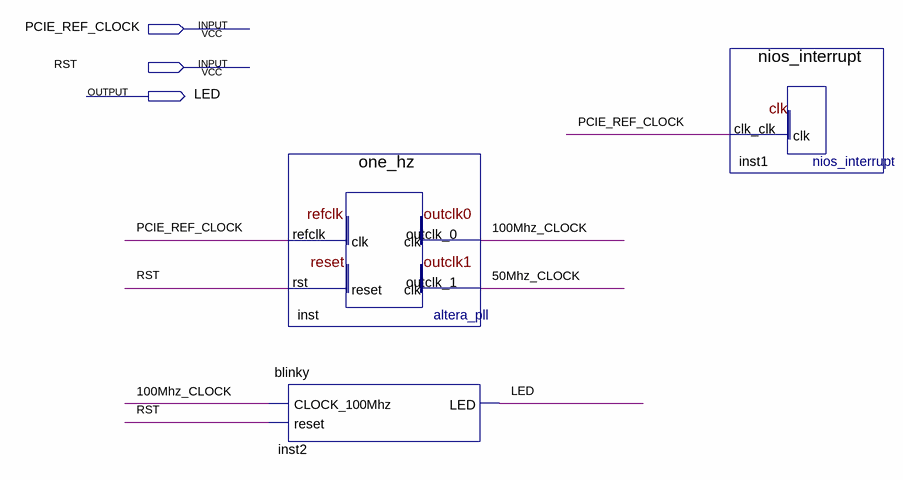
[diagram p0: schematic sheet]
// Quartus schematic Top_module.bdf as structural Verilog: 3 symbols, 3 pins
module Top_module (
  input  PCIE_REF_CLOCK,
  input  RST,
  output LED
);

  wire \50Mhz_CLOCK , \100Mhz_CLOCK ;

  one_hz inst (.refclk(PCIE_REF_CLOCK), .rst(RST), .outclk_0(\100Mhz_CLOCK ), .outclk_1(\50Mhz_CLOCK ));
  blinky inst2 (.CLOCK_100Mhz(\100Mhz_CLOCK ), .reset(RST), .LED(LED));
  nios_interrupt inst1 (.clk_clk(PCIE_REF_CLOCK));
endmodule
